# Altium schematic sheet Heart_Rate.SchDoc: Heart Rate
size A; Revision: 1.0; SheetNumber: 2; SheetTotal: 6
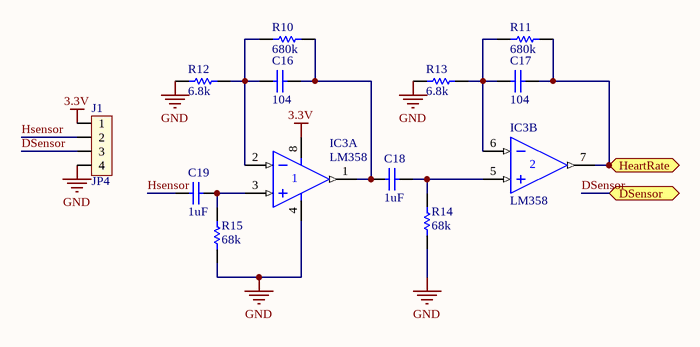
[diagram p0: Heart_Rate.SchDoc]

## Parts
C16  104  [Cap 0805]
C17  104  [Cap 0805]
C18  1uF  [Cap 0805]
C19  1uF  [Cap 0805]
IC3  LM358  [SOP-8]  (parts A,B of 2)
J1  JP4  [JP_CAI_4]
R10  680k  [RES 0805]
R11  680k  [RES 0805]
R12  6.8k  [RES 0805]
R13  6.8k  [RES 0805]
R14  68k  [RES 0805]
R15  68k  [RES 0805]

## Ports
DSensor, HeartRate

## Nets
3.3V: IC3.8(V+) J1.1
GND: IC3.4(V-) J1.4 R12.2 R13.2 R14.1 R15.1
DSensor: J1.3 ; port DSensor
HeartRate: C17.1 IC3.7(OUT) R11.1 ; port HeartRate
Hsensor: C19.2 J1.2
NetC16_1: C16.1 C18.2 IC3.1(OUT) R10.1
NetC16_2: C16.2 IC3.2(IN-) R10.2 R12.1
NetC17_2: C17.2 IC3.6(IN-) R11.2 R13.1
NetC18_1: C18.1 IC3.5(IN+) R14.2
NetC19_1: C19.1 IC3.3(IN+) R15.2

## Notes on the sheet
- Title
- Size:
- Date:
- A
- Number:
- Time:
- Revision:
- Sheet
- of
- File:

## Library data of the parts
C16-C19 = Cap_0805
IC3 = LM358_SMD: LM358_OPAMP
R10-R15 = Res_0805: resistor smd0805